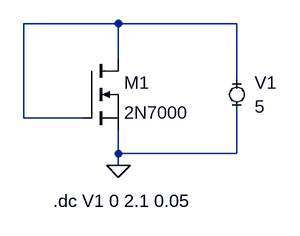
[diagram p0: schematic Draft2.asc]
Draft2.asc, the LTspice schematic file:
Version 4
SHEET 1 880 680
WIRE 224 80 96 80
WIRE 384 80 224 80
WIRE 224 128 224 80
WIRE 384 160 384 80
WIRE 96 208 96 80
WIRE 176 208 96 208
WIRE 224 256 224 224
WIRE 384 256 384 192
WIRE 384 256 224 256
WIRE 224 272 224 256
FLAG 224 272 0
SYMBOL nmos 176 128 R0
SYMATTR InstName M1
SYMATTR Value 2N7000
SYMBOL MiniSyms4\\voltage- 384 176 R0
WINDOW 123 0 0 Left 2
WINDOW 39 0 0 Left 2
SYMATTR InstName V1
SYMATTR Value 5
TEXT 136 320 Left 2 !.dc V1 0 2.1 0.05

The netlist it stands for:
* Draft2.asc
M1 N001 N001 0 0 2N7000
V1 N001 0 5
.model NMOS NMOS
.model PMOS PMOS
.lib standard.mos
.dc V1 0 2.1 0.05
.backanno
.end